# Altium schematic sheet Sheet1.SchDoc
size B
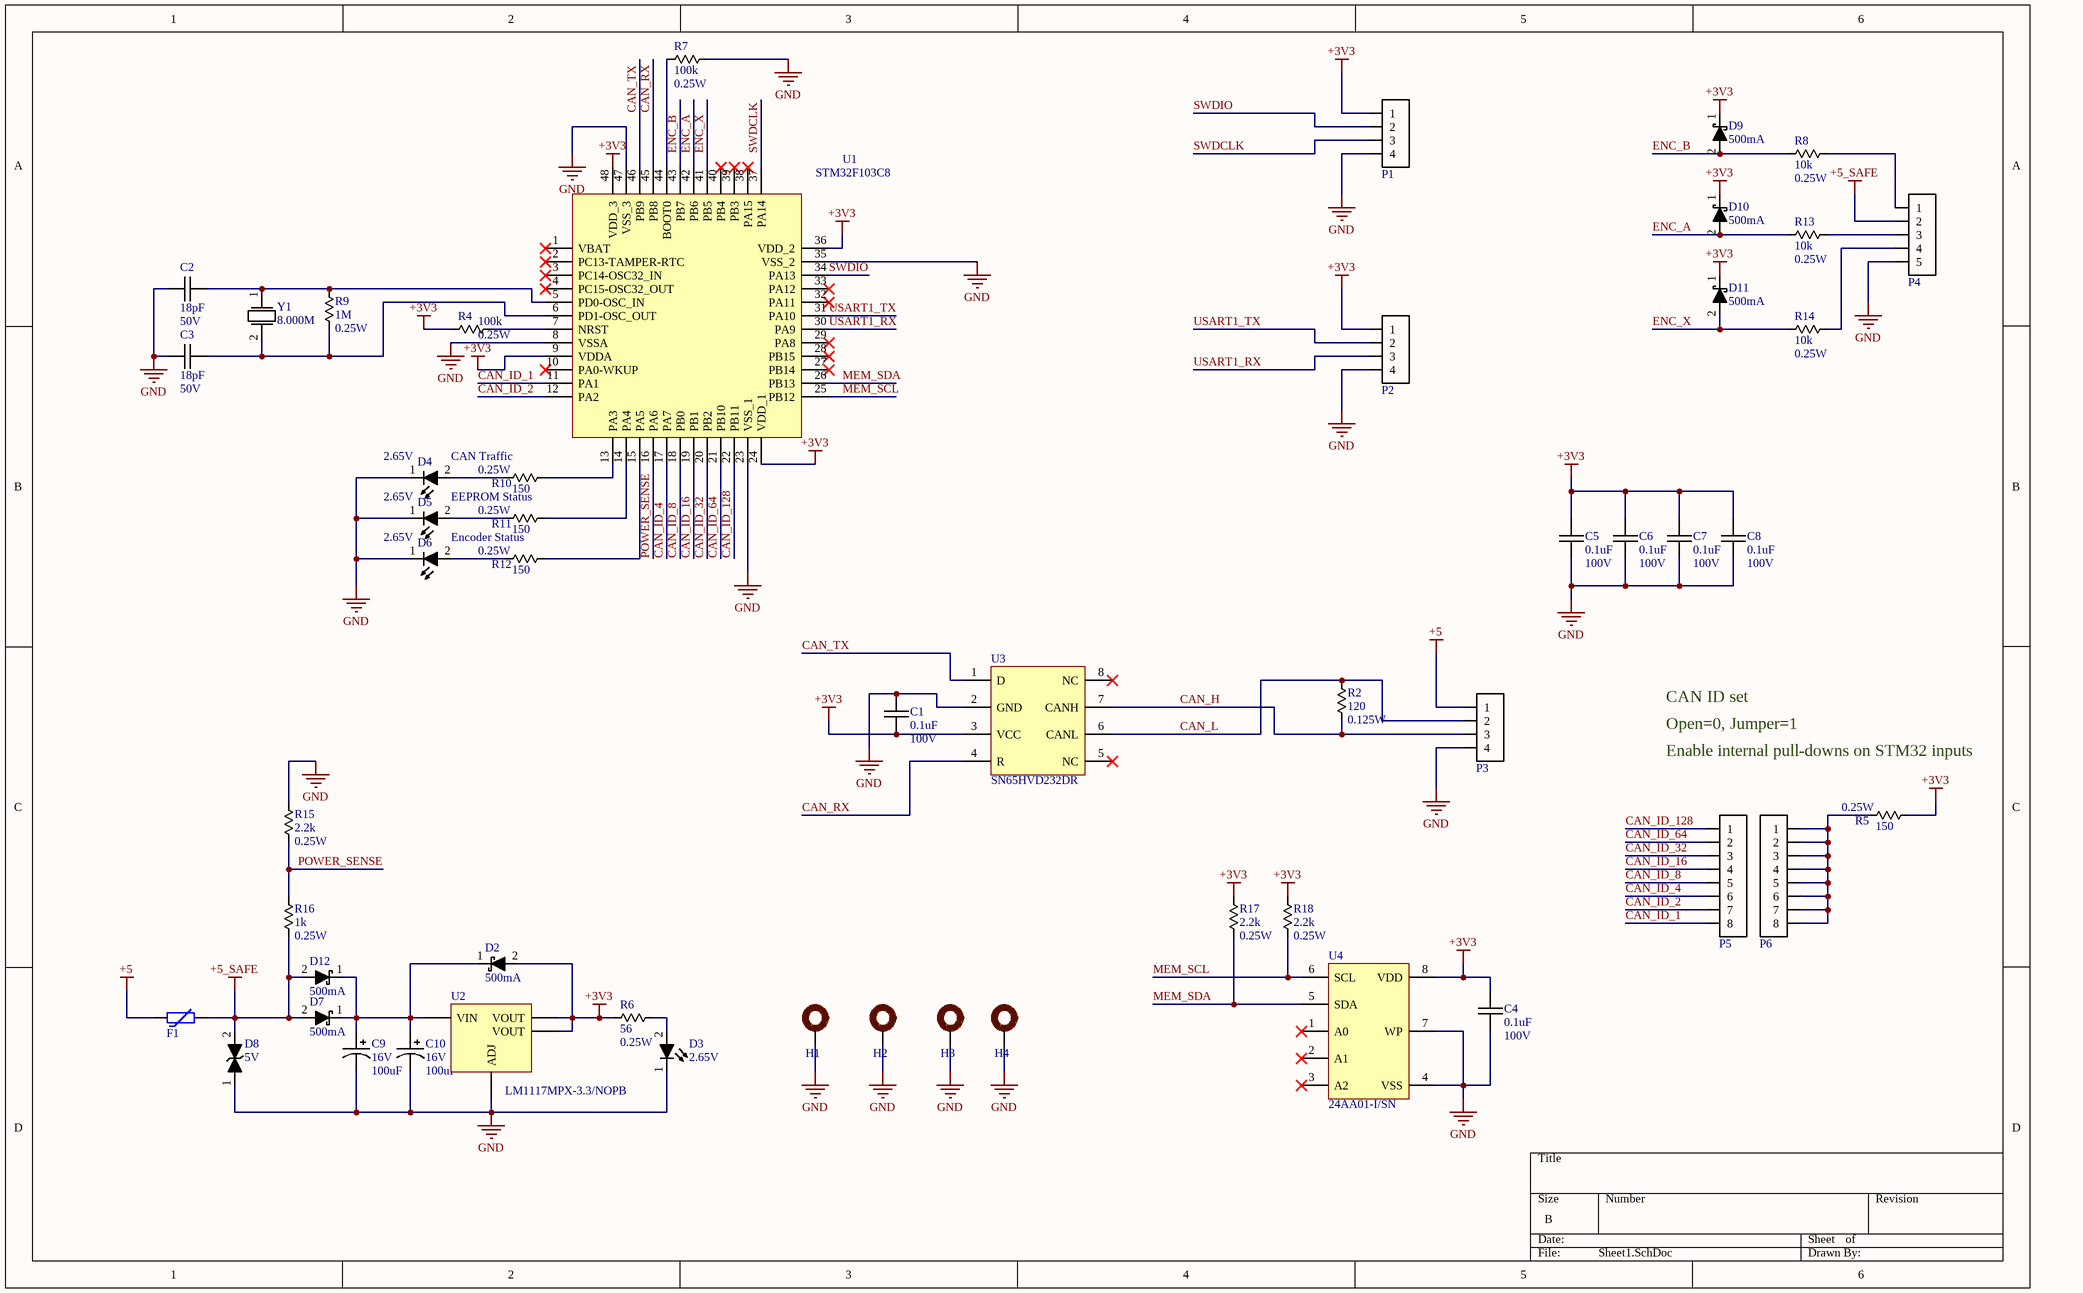
[diagram p0: Sheet1.SchDoc]

## Parts
C1  Capacitance: 0.1uF  Voltage Rating: 100V  [chip_0603]  (hidden comment: cap_single_np)
C2  Capacitance: 18pF  Voltage Rating: 50V  [chip_0603]  (hidden comment: cap_single_np)
C3  Capacitance: 18pF  Voltage Rating: 50V  [chip_0603]  (hidden comment: cap_single_np)
C4  Capacitance: 0.1uF  Voltage Rating: 100V  [chip_0603]  (hidden comment: cap_single_np)
C5  Capacitance: 0.1uF  Voltage Rating: 100V  [chip_0603]  (hidden comment: cap_single_np)
C6  Capacitance: 0.1uF  Voltage Rating: 100V  [chip_0603]  (hidden comment: cap_single_np)
C7  Capacitance: 0.1uF  Voltage Rating: 100V  [chip_0603]  (hidden comment: cap_single_np)
C8  Capacitance: 0.1uF  Voltage Rating: 100V  [chip_0603]  (hidden comment: cap_single_np)
C9  Voltage Rating: 16V  Capacitance: 100uF  [chip_2917_AVX_TAJD]  (hidden comment: cap_single_p)
C10  Voltage Rating: 16V  Capacitance: 100uF  [chip_2917_AVX_TAJD]  (hidden comment: cap_single_p)
D2  Current Rating: 500mA  [sod323_0]  (hidden comment: diode_2)
D3  Forward Voltage: 2.65V  [chip_0603]  (hidden comment: diode_4)
D4  Forward Voltage: 2.65V  [chip_0603]  (hidden comment: diode_4)
D5  Forward Voltage: 2.65V  [chip_0603]  (hidden comment: diode_4)
D6  Forward Voltage: 2.65V  [chip_0603]  (hidden comment: diode_4)
D7  Current Rating: 500mA  [sod323_0]  (hidden comment: diode_2)
D8  Reverse Breakdown Voltage: 5V  [sod323_0]  (hidden comment: diode_5)
D9  Current Rating: 500mA  [sod323_0]  (hidden comment: diode_2)
D10  Current Rating: 500mA  [sod323_0]  (hidden comment: diode_2)
D11  Current Rating: 500mA  [sod323_0]  (hidden comment: diode_2)
D12  Current Rating: 500mA  [sod323_0]  (hidden comment: diode_2)
F1  PTC_0  [chip_1206]  (value not drawn)
H1  mounting_hole_0  [#8-32_SOCKET_HEAD]  (value not drawn)
H2  mounting_hole_0  [#8-32_SOCKET_HEAD]  (value not drawn)
H3  mounting_hole_0  [#8-32_SOCKET_HEAD]  (value not drawn)
H4  mounting_hole_0  [#8-32_SOCKET_HEAD]  (value not drawn)
P1  conn-4x1_0  [HDDR_4x1_0]  (value not drawn)
P2  conn-4x1_0  [HDDR_4x1_0]  (value not drawn)
P3  conn-4x1_0  [TERM_3.50MM_4x1_0]  (value not drawn)
P4  conn-5x1_0  [JST_PHR_5_0]  (value not drawn)
P5  conn-8x1_0  [hddr_8x1_0]  (value not drawn)
P6  conn-8x1_0  [hddr_8x1_0]  (value not drawn)
R2  Resistance: 120  Power Rating: 0.125W  [chip_0805]  (hidden comment: res_single)
R4  Resistance: 100k  Power Rating: 0.25W  [chip_0603]  (hidden comment: res_single)
R5  Resistance: 150  Power Rating: 0.25W  [chip_0603]  (hidden comment: res_single)
R6  Resistance: 56  Power Rating: 0.25W  [chip_0603]  (hidden comment: res_single)
R7  Resistance: 100k  Power Rating: 0.25W  [chip_0603]  (hidden comment: res_single)
R8  Resistance: 10k  Power Rating: 0.25W  [chip_0603]  (hidden comment: res_single)
R9  Resistance: 1M  Power Rating: 0.25W  [chip_0603]  (hidden comment: res_single)
R10  Resistance: 150  Power Rating: 0.25W  [chip_0603]  (hidden comment: res_single)
R11  Resistance: 150  Power Rating: 0.25W  [chip_0603]  (hidden comment: res_single)
R12  Resistance: 150  Power Rating: 0.25W  [chip_0603]  (hidden comment: res_single)
R13  Resistance: 10k  Power Rating: 0.25W  [chip_0603]  (hidden comment: res_single)
R14  Resistance: 10k  Power Rating: 0.25W  [chip_0603]  (hidden comment: res_single)
R15  Resistance: 2.2k  Power Rating: 0.25W  [chip_0603]  (hidden comment: res_single)
R16  Resistance: 1k  Power Rating: 0.25W  [chip_0603]  (hidden comment: res_single)
R17  Resistance: 2.2k  Power Rating: 0.25W  [chip_0603]  (hidden comment: res_single)
R18  Resistance: 2.2k  Power Rating: 0.25W  [chip_0603]  (hidden comment: res_single)
U1  STM32F103C8  [LQFP48_0]
U2  Manufacturer PN: LM1117MPX-3.3/NOPB  [sot-223-4]  (hidden comment: LM1117)
U3  Manufacturer PN: SN65HVD232DR  [SO-8]  (hidden comment: SN65HVD232)
U4  Manufacturer PN: 24AA01-I/SN  [SO-8]  (hidden comment: 24AA01)
Y1  Frequency: 8.000M  [ABLS_AT49_OSC]  (hidden comment: osc_xtal_2p_0)

## Nets
+3V3: C1.2 C4.1 C5.2 C6.2 C7.2 C8.2 D2.2 D9.1 D10.1 D11.1 P1.1 P2.1 R4.2 R5.2 R6.1 R17.1 R18.1 U1.9(VDDA) U1.24(VDD_1) U1.36(VDD_2) U1.48(VDD_3) U2.2(VOUT) U2.4(VOUT) U3.3(VCC) U4.8(VDD)
+5: F1.1 P3.1
+5_SAFE: D7.2 D8.2 D12.2 F1.2 P4.2 R16.2
GND: C1.1 C2.2 C3.2 C4.2 C5.1 C6.1 C7.1 C8.1 C9.2 C10.2 D3.1 D4.1 D5.1 D6.1 D8.1 H1.0(A) H2.0(A) H3.0(A) H4.0(A) P1.4 P2.4 P3.4 P4.5 R7.1 R15.1 U1.8(VSSA) U1.23(VSS_1) U1.35(VSS_2) U1.47(VSS_3) U2.1(ADJ) U3.2(GND) U4.4(VSS) U4.7(WP)
CAN_H: P3.3 R2.2 U3.7(CANH)
CAN_ID_1: P5.8 U1.11(PA1)
CAN_ID_2: P5.7 U1.12(PA2)
CAN_ID_4: P5.6 U1.17(PA7)
CAN_ID_8: P5.5 U1.18(PB0)
CAN_ID_16: P5.4 U1.19(PB1)
CAN_ID_32: P5.3 U1.20(PB2)
CAN_ID_64: P5.2 U1.21(PB10)
CAN_ID_128: P5.1 U1.22(PB11)
CAN_L: P3.2 R2.1 U3.6(CANL)
CAN_RX: U1.45(PB8) U3.4(R)
CAN_TX: U1.46(PB9) U3.1(D)
ENC_A: D10.2 R13.1 U1.42(PB6)
ENC_B: D9.2 R8.1 U1.43(PB7)
ENC_X: D11.2 R14.1 U1.41(PB5)
MEM_SCL: R18.2 U1.25(PB12) U4.6(SCL)
MEM_SDA: R17.2 U1.26(PB13) U4.5(SDA)
POWER_SENSE: R15.2 R16.1 U1.16(PA6)
SWDCLK: P1.3 U1.37(PA14)
SWDIO: P1.2 U1.34(PA13)
USART1_RX: P2.3 U1.30(PA9)
USART1_TX: P2.2 U1.31(PA10)
NetC2_1: C2.1 R9.1 U1.5(PD0-OSC_IN) Y1.1
NetC3_1: C3.1 R9.2 U1.6(PD1-OSC_OUT) Y1.2
NetC9_1: C9.1 C10.1 D2.1 D7.1 D12.1 U2.3(VIN)
NetD3_2: D3.2 R6.2
NetD4_2: D4.2 R10.1
NetD5_2: D5.2 R11.1
NetD6_2: D6.2 R12.1
NetP4_1: P4.1 R8.2
NetP4_3: P4.3 R13.2
NetP4_4: P4.4 R14.2
NetP6_1: P6.1 P6.2 P6.3 P6.4 P6.5 P6.6 P6.7 P6.8 R5.1
NetR4_1: R4.1 U1.7(NRST)
NetR7_2: R7.2 U1.44(BOOT0)
NetR10_2: R10.2 U1.13(PA3)
NetR11_2: R11.2 U1.14(PA4)
NetR12_2: R12.2 U1.15(PA5)

Not connected (* = marked no-connect by the designer): U1 1(VBAT)* 2(PC13-TAMPER-RTC)* 3(PC14-OSC32_IN)* 4(PC15-OSC32_OUT)* 10(PA0-WKUP)* 27(PB14)* 28(PB15)* 29(PA8)* 32(PA11)* 33(PA12)* 38(PA15)* 39(PB3)* 40(PB4)*; U3 5(NC)* 8(NC)*; U4 1(A0)* 2(A1)* 3(A2)*

## Notes on the sheet
- CAN Traffic
- EEPROM Status
- Encoder Status
- CAN ID set
- Open=0, Jumper=1
- Enable internal pull-downs on STM32 inputs

## Library data of the parts
C1 C4 = CAP-00477: CAP, 0.1uF, ±10%, 100V, X7R, 0603; Manufacturer: Murata; Manufacturer PN: GRM188R72A104KA35D; Tolerance: ±10%; Part Number: CAP-00477; Type: X7R
C2 C3 = CAP-00409: CAP, 18pF, ±2%, 50V, C0G, 0603; Manufacturer: Murata; Manufacturer PN: GRM1885C1H180GA01D; Tolerance: ±2%; Part Number: CAP-00409; Type: C0G
C5-C8 = CAP-00530: CAP, 0.1uF, ±10%, 100V, X7R, 0603; Manufacturer: Murata; Manufacturer PN: GRM188R72A104KA35J; Tolerance: ±10%; Part Number: CAP-00530; Type: X7R
C9 C10 = CAP-00550: CAP, 100uF, ±10%, 16V, Tantalum, 2917; Manufacturer: AVX; Manufacturer PN: TAJD107K016RNJ; Tolerance: ±10%; Part Number: CAP-00550; Type: Tantalum; Cost: $0.94
D2 D7 D9-D12 = DIO-00000: Dio Shtky, 500mA, 0.62V, 30V, SOD-323; Manufacturer: ON Semi; Manufacturer PN: NSR0530HT1G; Forward Voltage: 620mV; Type: Schottky; Reverse Breakdown Voltage: 30V; Part Number: DIO-00000
D3 = DIO-00050: LED, Green, 0603, Low current, HELI2 Series; Manufacturer: Kingbright; Manufacturer PN: APT1608LZGCK; Reverse Breakdown Voltage: 5V; Current Rating: 30mA; Power Rating: 120mW; Type: LED; Part Number: DIO-00050; Cost: 0.58
D4-D6 = DIO-00049: LED, Blue, 0603, Low current, HELI2 Series; Manufacturer: Kingbright; Manufacturer PN: APT1608LVBC/D; Reverse Breakdown Voltage: 5V; Current Rating: 30mA; Power Rating: 120mW; Type: LED; Part Number: DIO-00049; Cost: 0.58
D8 = DIO-00037: TVS, 5V, 500W; Manufacturer: ST; Manufacturer PN: ESDA8V2-1J; Forward Voltage: *; Type: TVS; Current Rating: *; Part Number: DIO-00037; Power Rating: 500W
F1 = MISC-00008: PTC Resettable fuse, 6V, 500mA, 1206; Manufacturer: Eaton; Manufacturer PN: PTS12066V050; TEMP_CO: *; Part Number: MISC-00008; Cost: 0.3
H1-H4 = MISC-00027: #8-32 Mounting Hole for Socket Head Cap Screw; Part Number: MISC-00027
P1 P2 = CONN-00029: Header 4x1, 0.1"; Positions per level: 4; Levels: 1; Part Number: CONN-00029; Type: Header
P3 = CONN-00024: Term Blk, 4 Pos, 16A, 3.5mm Pitch; Manufacturer: Phoenix Contact; Manufacturer PN: 1861959; Positions per level: 4; Levels: 1; Current: 16; Part Number: CONN-00024; Type: Terminal Block; Cost: 1.67
P4 = CONN-00016: JST PHR 5x1; Positions per level: 5; Levels: 1; Part Number: CONN-00016; Type: Header; Manufacturer: JST
P5 P6 = CONN-00003: Header 8x1, 0.1"; Positions per level: 8; Levels: 1; Part Number: CONN-00003
R2 = RES-00183: RES SMD 120 OHM 1% 1/8W 0805; Manufacturer: Rohm Semiconductor; Manufacturer PN: KTR10EZPF1200; Tolerance: 1%; Part Number: RES-00183
R4 R7 = RES-00301: RES SMD 100K OHM 1% 1/4W 0603; Manufacturer: Panasonic; Manufacturer PN: ERJ-PA3F1003V; Tolerance: 1%; Part Number: RES-00301
R5 R10-R12 = RES-00188: RES SMD 150 OHM 1% 1/4W 0603; Manufacturer: Panasonic; Manufacturer PN: ERJ-PA3F1500V; Tolerance: 1%; Part Number: RES-00188
R6 = RES-00159: RES SMD 56 OHM 1% 1/4W 0603; Manufacturer: Panasonic; Manufacturer PN: ERJ-PA3F56R0V; Tolerance: 1%; Part Number: RES-00159
R8 R13 R14 = RES-00306: RES SMD 10K OHM 1% 1/4W 0603; Manufacturer: Panasonic; Manufacturer PN: ERJ-PA3F1002V; Tolerance: 1%; Part Number: RES-00306; Cost: 0.144
R9 = RES-00362: RES SMD 1M OHM 1% 1/4W 0603; Manufacturer: Panasonic; Manufacturer PN: ERJ-PA3F1004V; Tolerance: 1%; Part Number: RES-00362
R15 R17 R18 = RES-00365: RES SMD 2.2K OHM 1% 1/4W 0603; Manufacturer: Panasonic; Manufacturer PN: ERJ-PA3F2201V; Tolerance: 1%; Part Number: RES-00365
R16 = RES-00360: RES SMD 1K OHM 1% 1/4W 0603; Manufacturer: Panasonic; Manufacturer PN: ERJ-PA3F1001V; Tolerance: 1%; Part Number: RES-00360
U1 = UCTRL-00008: STM32 M3, LQFP-48; Manufacturer: ST; Manufacturer PN: STM32F103C8; Part Number: UCTRL-00008
U2 = PWREG-00018: REG, Linear, Fixed 3V3, 800mA, SOT-223; Manufacturer: TI; Voltage Range In: 4.5 - 15V; Voltage Range Out: 3.3V; Part Number: PWREG-00018; Max Current: 800mA; Reg Type: Linear; Fixed/Adj: Fixed; Cost: 1.14
U3 = IFACE-00008: CANbus Transceiver, Single channel, SN65HVD232; Manufacturer: TI; Part Number: IFACE-00008; Cost: 2.01
U4 = LOGIC-00028: EEPROM, 1K-bit, I2C, 400kHz, 24AA01, 8-SOIC; Manufacturer: Microchip; Part Number: LOGIC-00028; Cost: $0.20
Y1 = OSC-00002: XTAL, 8MHz, 18pF, 20ppm; Manufacturer: Abracon; Manufacturer PN: ABLS-8.000MHZ-B2-T; ESR: 80; Stability: 50ppm; Load Capacitance: 18pF; Tolerance: 20ppm; Part Number: OSC-00002